# Altium schematic sheet Initital Sheetmap.SchDoc
size A; SheetNumber: 4; SheetTotal: 4
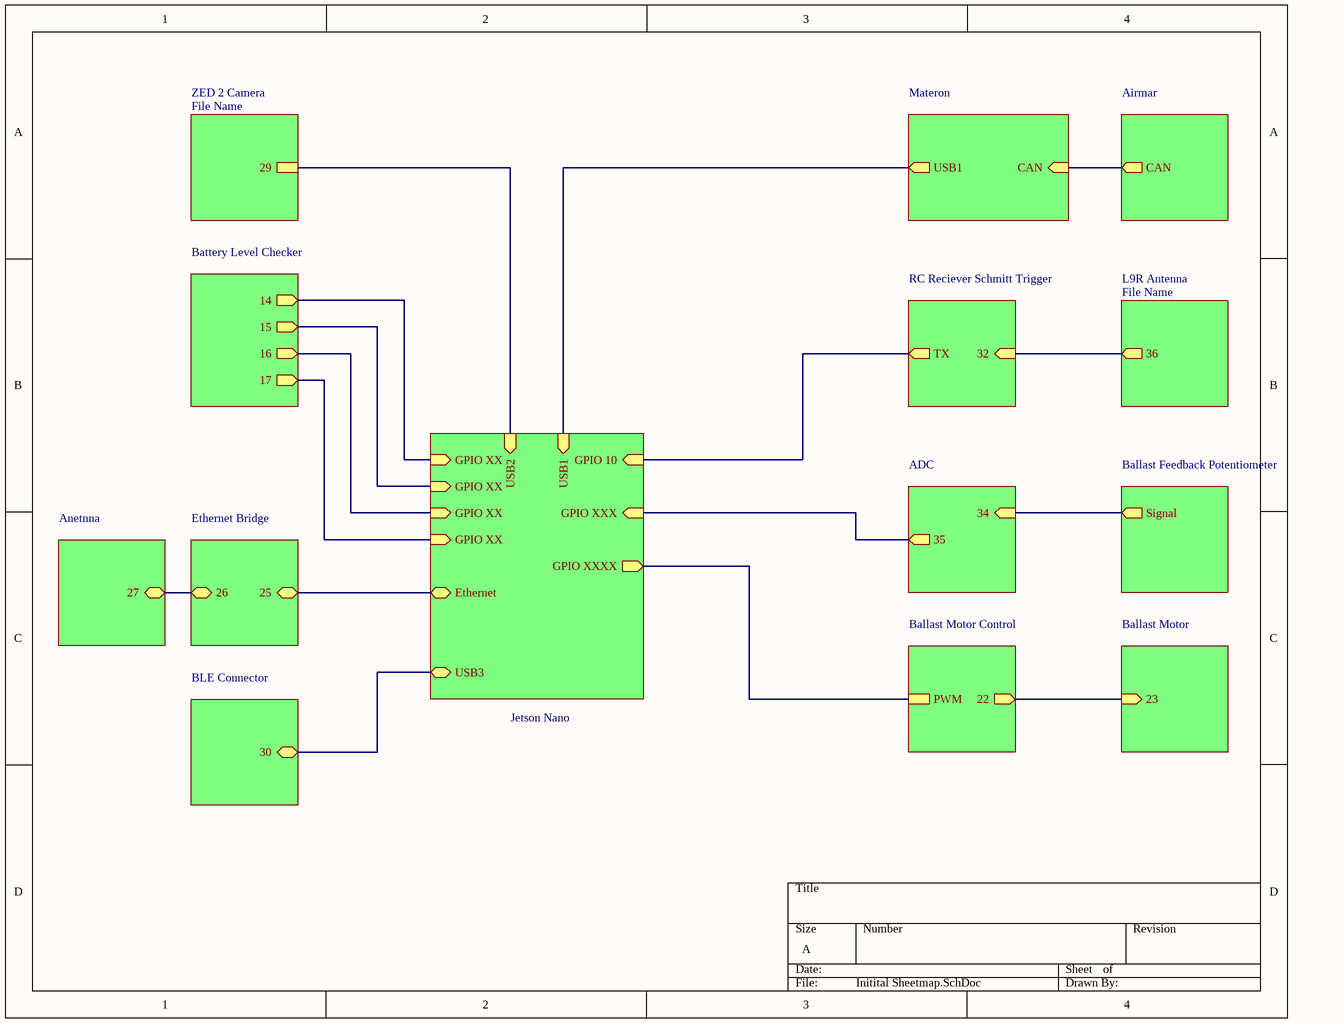
[diagram p0: Initital Sheetmap.SchDoc]

## Sub-sheets
ADC = File Name: 34 (in), 35 (out)
Airmar = File Name: CAN (out)
Anetnna = File Name: 27 (bidir)
Ballast Feedback Potentiometer = File Name: Signal (out)
Ballast Motor = File Name: 23 (in)
Ballast Motor Control = File Name: PWM, 22 (out)
Battery Level Checker = File Name: 14 (out), 15 (out), 16 (out), 17 (out)
BLE Connector = File Name: 30 (bidir)
Ethernet Bridge = File Name: 25 (bidir), 26 (bidir)
Jetson Nano = File Name: GPIO 10 (in), GPIO XXX (in), GPIO XXXX (out), USB1 (in), GPIO XX (in), GPIO XX (in), GPIO XX (in), GPIO XX (in), Ethernet (bidir), USB2 (in), USB3 (bidir)
L9R Antenna = File Name: 36 (out)
Materon = File Name: USB1 (out), CAN (in)
RC Reciever Schmitt Trigger = File Name: TX (out), 32 (in)
ZED 2 Camera = File Name: 29

## Nets
(unnamed): sheet Jetson Nano/GPIO 10, sheet RC Reciever Schmitt Trigger/TX
(unnamed): sheet Jetson Nano/GPIO XXX, sheet ADC/35
(unnamed): sheet Jetson Nano/GPIO XXXX, sheet Ballast Motor Control/PWM
(unnamed): sheet Jetson Nano/USB1, sheet Materon/USB1
(unnamed): sheet Jetson Nano/GPIO XX, sheet Battery Level Checker/14
(unnamed): sheet Jetson Nano/GPIO XX, sheet Battery Level Checker/15
(unnamed): sheet Jetson Nano/GPIO XX, sheet Battery Level Checker/16
(unnamed): sheet Jetson Nano/GPIO XX, sheet Battery Level Checker/17
(unnamed): sheet Jetson Nano/Ethernet, sheet Ethernet Bridge/25
(unnamed): sheet Jetson Nano/USB2, sheet ZED 2 Camera/29
(unnamed): sheet Jetson Nano/USB3, sheet BLE Connector/30
(unnamed): sheet RC Reciever Schmitt Trigger/32, sheet L9R Antenna/36
(unnamed): sheet Ballast Feedback Potentiometer/Signal, sheet ADC/34
(unnamed): sheet Ballast Motor Control/22, sheet Ballast Motor/23
(unnamed): sheet Materon/CAN, sheet Airmar/CAN
(unnamed): sheet Ethernet Bridge/26, sheet Anetnna/27